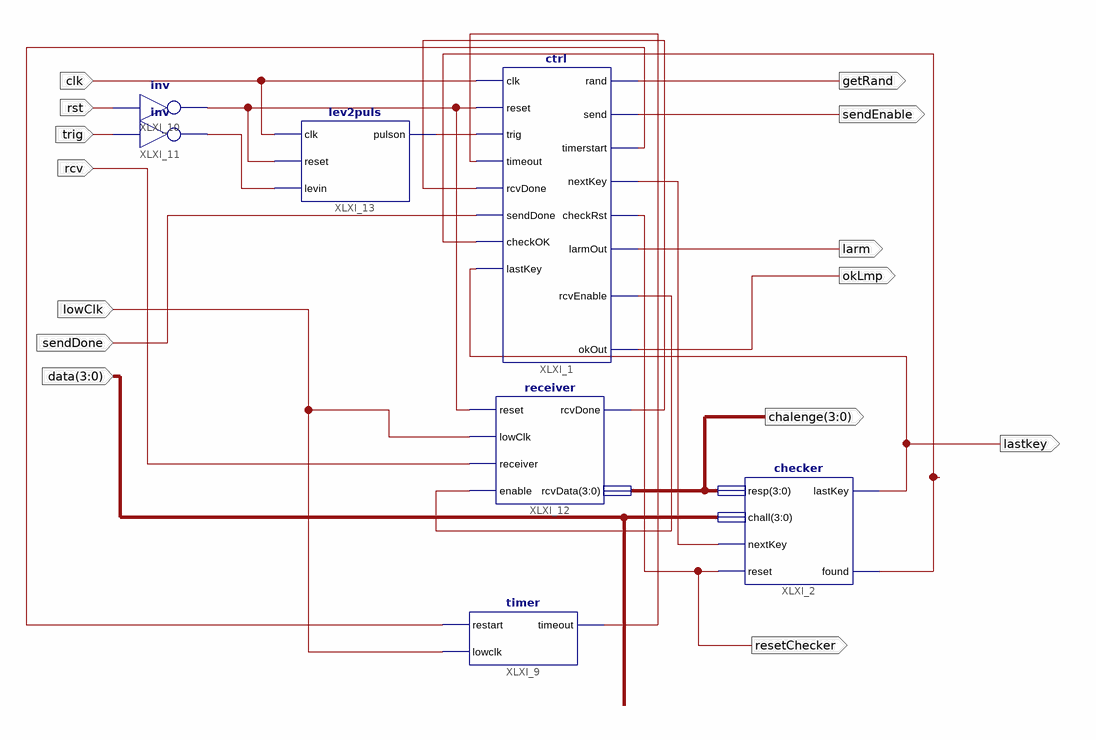
[diagram p0: schematic sheet 1]
// Xilinx ISE schematic top.sch (xc9500xl) as structural Verilog: 7 symbols, 14 ports
module top (
  input  sendDone,
  input  [3:0] data,
  input  clk,
  input  rst,
  input  trig,
  input  lowClk,
  input  rcv,
  output resetChecker,
  output lastkey,
  output getRand,
  output sendEnable,
  output larm,
  output [3:0] chalenge,
  output okLmp
);

  wire found, Timeout, XLXN_4, XLXN_30, XLXN_84, XLXN_85, XLXN_106, XLXN_109, XLXN_110;

  ctrl XLXI_1 (
    .clk(clk), .reset(XLXN_109), .trig(XLXN_110), .timeout(Timeout), .rcvDone(XLXN_84), .sendDone(sendDone),
    .checkOK(found), .lastKey(lastkey), .\rand (getRand), .send(sendEnable), .rcvEnable(XLXN_85),
    .timerstart(XLXN_30), .nextKey(XLXN_4), .checkRst(resetChecker), .larmOut(larm), .okOut(okLmp));
  not XLXI_10 (XLXN_109, rst);
  not XLXI_11 (XLXN_106, trig);
  \checker  XLXI_2 (
    .resp(chalenge), .chall(data), .nextKey(XLXN_4), .reset(resetChecker), .lastKey(lastkey), .found(found));
  timer XLXI_9 (.restart(XLXN_30), .lowclk(lowClk), .timeout(Timeout));
  receiver XLXI_12 (
    .reset(XLXN_109), .lowClk(lowClk), .receiver(rcv), .enable(XLXN_85), .rcvDone(XLXN_84), .rcvData(chalenge));
  lev2puls XLXI_13 (.clk(clk), .reset(XLXN_109), .levin(XLXN_106), .pulson(XLXN_110));
endmodule
